# EAGLE design FY - OPTO_BOARD_2_MISC (EAGLE 6.1)
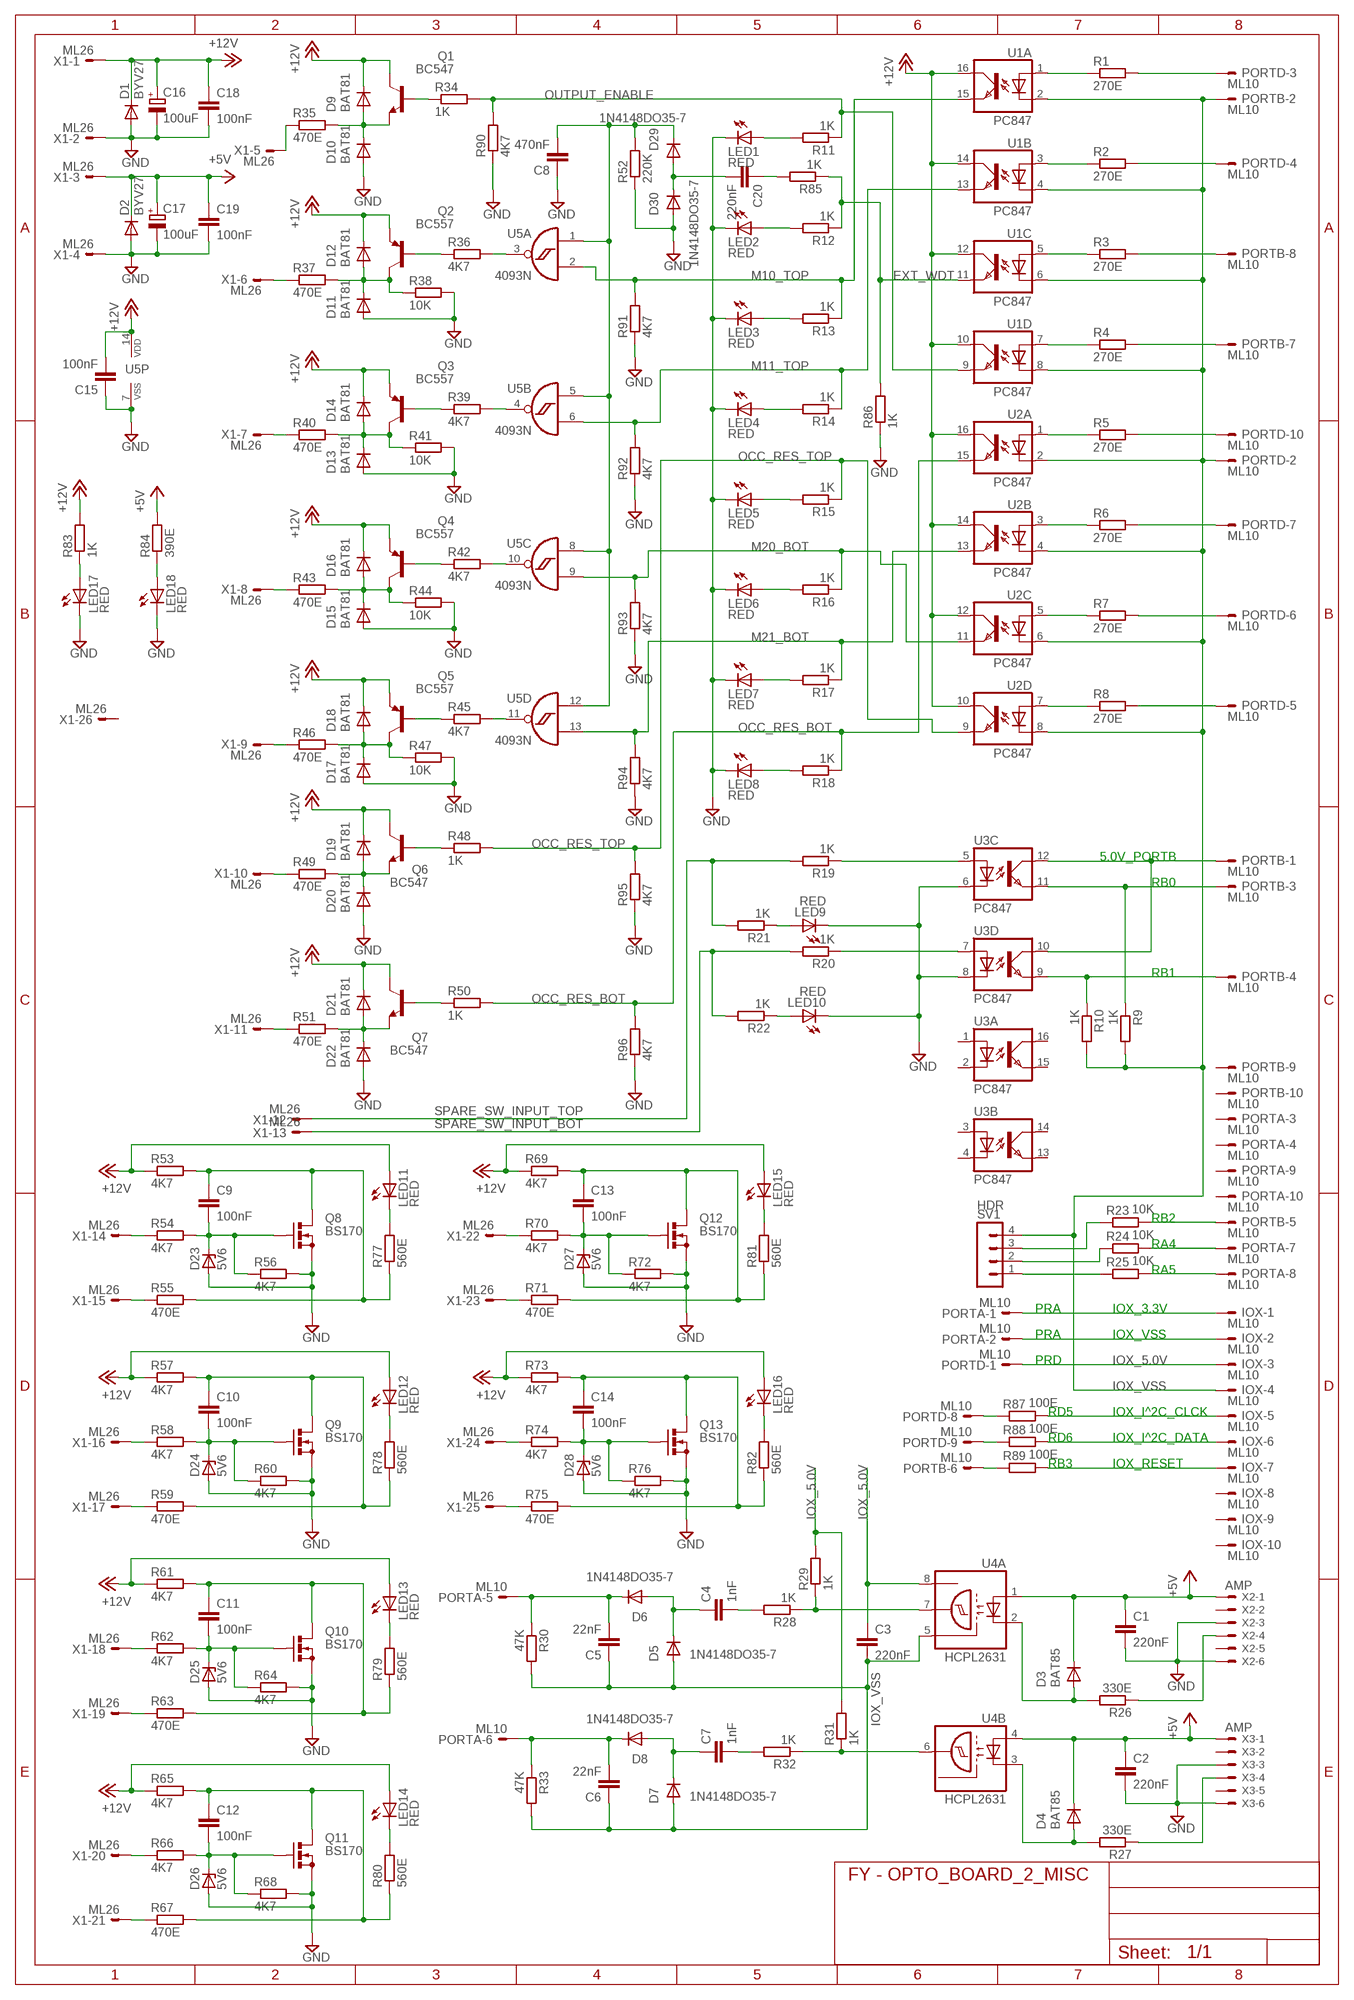
[diagram p0: schematic, sheet 1]

## Parts
C1  220nF  C-EU050-025X075  [C050-025X075]
C2  220nF  C-EU050-025X075  [C050-025X075]
C3  220nF  C-EU050-025X075  [C050-025X075]
C4  1nF  C-EU050-025X075  [C050-025X075]
C5  22nF  C-EU050-025X075  [C050-025X075]
C6  22nF  C-EU050-025X075  [C050-025X075]
C7  1nF  C-EU050-025X075  [C050-025X075]
C8  470nF  C-EU050-025X075  [C050-025X075]
C9  100nF  C-EU050-025X075  [C050-025X075]
C10  100nF  C-EU050-025X075  [C050-025X075]
C11  100nF  C-EU050-025X075  [C050-025X075]
C12  100nF  C-EU050-025X075  [C050-025X075]
C13  100nF  C-EU050-025X075  [C050-025X075]
C14  100nF  C-EU050-025X075  [C050-025X075]
C15  100nF  C-EU050-025X075  [C050-025X075]
C16  100uF  CPOL-EUE5-8.5  [E5-8,5]
C17  100uF  CPOL-EUE5-8.5  [E5-8,5]
C18  100nF  C-EU050-025X075  [C050-025X075]
C19  100nF  C-EU050-025X075  [C050-025X075]
C20  220nF  C-EU050-025X075  [C050-025X075]
D1  BYV27  [SOD57-10]
D2  BYV27  [SOD57-10]
D3  BAT85  BAT81  [DO34-7]
D4  BAT85  BAT81  [DO34-7]
D5  1N4148DO35-7  [DO35-7]
D6  1N4148DO35-7  [DO35-7]
D7  1N4148DO35-7  [DO35-7]
D8  1N4148DO35-7  [DO35-7]
D9  BAT81  [DO34-7]
D10  BAT81  [DO34-7]
D11  BAT81  [DO34-7]
D12  BAT81  [DO34-7]
D13  BAT81  [DO34-7]
D14  BAT81  [DO34-7]
D15  BAT81  [DO34-7]
D16  BAT81  [DO34-7]
D17  BAT81  [DO34-7]
D18  BAT81  [DO34-7]
D19  BAT81  [DO34-7]
D20  BAT81  [DO34-7]
D21  BAT81  [DO34-7]
D22  BAT81  [DO34-7]
D23  5V6  ZENER-DIODEDO34-7  [DO34Z7]
D24  5V6  ZENER-DIODEDO34-7  [DO34Z7]
D25  5V6  ZENER-DIODEDO34-7  [DO34Z7]
D26  5V6  ZENER-DIODEDO34-7  [DO34Z7]
D27  5V6  ZENER-DIODEDO34-7  [DO34Z7]
D28  5V6  ZENER-DIODEDO34-7  [DO34Z7]
D29  1N4148DO35-7  [DO35-7]
D30  1N4148DO35-7  [DO35-7]
IOX  ML10  ML10E  [ML10]
LED1  RED  LED3MM  [LED3MM]
LED2  RED  LED3MM  [LED3MM]
LED3  RED  LED3MM  [LED3MM]
LED4  RED  LED3MM  [LED3MM]
LED5  RED  LED3MM  [LED3MM]
LED6  RED  LED3MM  [LED3MM]
LED7  RED  LED3MM  [LED3MM]
LED8  RED  LED3MM  [LED3MM]
LED9  RED  LED3MM  [LED3MM]
LED10  RED  LED3MM  [LED3MM]
LED11  RED  LED3MM  [LED3MM]
LED12  RED  LED3MM  [LED3MM]
LED13  RED  LED3MM  [LED3MM]
LED14  RED  LED3MM  [LED3MM]
LED15  RED  LED3MM  [LED3MM]
LED16  RED  LED3MM  [LED3MM]
LED17  RED  LED3MM  [LED3MM]
LED18  RED  LED3MM  [LED3MM]
PORTA  ML10  ML10E  [ML10]
PORTB  ML10  ML10E  [ML10]
PORTD  ML10  ML10E  [ML10]
Q1  BC547  [TO92]
Q2  BC557  [TO92]
Q3  BC557  [TO92]
Q4  BC557  [TO92]
Q5  BC557  [TO92]
Q6  BC547  [TO92]
Q7  BC547  [TO92]
Q8  BS170  [SOT54E]
Q9  BS170  [SOT54E]
Q10  BS170  [SOT54E]
Q11  BS170  [SOT54E]
Q12  BS170  [SOT54E]
Q13  BS170  [SOT54E]
R1  270E  R-EU_0207/10  [0207/10]
R2  270E  R-EU_0207/10  [0207/10]
R3  270E  R-EU_0207/10  [0207/10]
R4  270E  R-EU_0207/10  [0207/10]
R5  270E  R-EU_0207/10  [0207/10]
R6  270E  R-EU_0207/10  [0207/10]
R7  270E  R-EU_0207/10  [0207/10]
R8  270E  R-EU_0207/10  [0207/10]
R9  1K  R-EU_0207/10  [0207/10]
R10  1K  R-EU_0207/10  [0207/10]
R11  1K  R-EU_0207/10  [0207/10]
R12  1K  R-EU_0207/10  [0207/10]
R13  1K  R-EU_0207/10  [0207/10]
R14  1K  R-EU_0207/10  [0207/10]
R15  1K  R-EU_0207/10  [0207/10]
R16  1K  R-EU_0207/10  [0207/10]
R17  1K  R-EU_0207/10  [0207/10]
R18  1K  R-EU_0207/10  [0207/10]
R19  1K  R-EU_0207/10  [0207/10]
R20  1K  R-EU_0207/10  [0207/10]
R21  1K  R-EU_0207/10  [0207/10]
R22  1K  R-EU_0207/10  [0207/10]
R23  10K  R-EU_0207/10  [0207/10]
R24  10K  R-EU_0207/10  [0207/10]
R25  10K  R-EU_0207/10  [0207/10]
R26  330E  R-EU_0207/10  [0207/10]
R27  330E  R-EU_0207/10  [0207/10]
R28  1K  R-EU_0207/10  [0207/10]
R29  1K  R-EU_0207/10  [0207/10]
R30  47K  R-EU_0207/10  [0207/10]
R31  1K  R-EU_0207/10  [0207/10]
R32  1K  R-EU_0207/10  [0207/10]
R33  47K  R-EU_0207/10  [0207/10]
R34  1K  R-EU_0207/10  [0207/10]
R35  470E  R-EU_0207/10  [0207/10]
R36  4K7  R-EU_0207/10  [0207/10]
R37  470E  R-EU_0207/10  [0207/10]
R38  10K  R-EU_0207/10  [0207/10]
R39  4K7  R-EU_0207/10  [0207/10]
R40  470E  R-EU_0207/10  [0207/10]
R41  10K  R-EU_0207/10  [0207/10]
R42  4K7  R-EU_0207/10  [0207/10]
R43  470E  R-EU_0207/10  [0207/10]
R44  10K  R-EU_0207/10  [0207/10]
R45  4K7  R-EU_0207/10  [0207/10]
R46  470E  R-EU_0207/10  [0207/10]
R47  10K  R-EU_0207/10  [0207/10]
R48  1K  R-EU_0207/10  [0207/10]
R49  470E  R-EU_0207/10  [0207/10]
R50  1K  R-EU_0207/10  [0207/10]
R51  470E  R-EU_0207/10  [0207/10]
R52  220K  R-EU_0207/10  [0207/10]
R53  4K7  R-EU_0207/10  [0207/10]
R54  4K7  R-EU_0207/10  [0207/10]
R55  470E  R-EU_0207/10  [0207/10]
R56  4K7  R-EU_0207/10  [0207/10]
R57  4K7  R-EU_0207/10  [0207/10]
R58  4K7  R-EU_0207/10  [0207/10]
R59  470E  R-EU_0207/10  [0207/10]
R60  4K7  R-EU_0207/10  [0207/10]
R61  4K7  R-EU_0207/10  [0207/10]
R62  4K7  R-EU_0207/10  [0207/10]
R63  470E  R-EU_0207/10  [0207/10]
R64  4K7  R-EU_0207/10  [0207/10]
R65  4K7  R-EU_0207/10  [0207/10]
R66  4K7  R-EU_0207/10  [0207/10]
R67  470E  R-EU_0207/10  [0207/10]
R68  4K7  R-EU_0207/10  [0207/10]
R69  4K7  R-EU_0207/10  [0207/10]
R70  4K7  R-EU_0207/10  [0207/10]
R71  470E  R-EU_0207/10  [0207/10]
R72  4K7  R-EU_0207/10  [0207/10]
R73  4K7  R-EU_0207/10  [0207/10]
R74  4K7  R-EU_0207/10  [0207/10]
R75  470E  R-EU_0207/10  [0207/10]
R76  4K7  R-EU_0207/10  [0207/10]
R77  560E  R-EU_0207/10  [0207/10]
R78  560E  R-EU_0207/10  [0207/10]
R79  560E  R-EU_0207/10  [0207/10]
R80  560E  R-EU_0207/10  [0207/10]
R81  560E  R-EU_0207/10  [0207/10]
R82  560E  R-EU_0207/10  [0207/10]
R83  1K  R-EU_0207/10  [0207/10]
R84  390E  R-EU_0207/10  [0207/10]
R85  1K  R-EU_0207/10  [0207/10]
R86  1K  R-EU_0207/10  [0207/10]
R87  100E  R-EU_0207/10  [0207/10]
R88  100E  R-EU_0207/10  [0207/10]
R89  100E  R-EU_0207/10  [0207/10]
R90  4K7  R-EU_0207/10  [0207/10]
R91  4K7  R-EU_0207/10  [0207/10]
R92  4K7  R-EU_0207/10  [0207/10]
R93  4K7  R-EU_0207/10  [0207/10]
R94  4K7  R-EU_0207/10  [0207/10]
R95  4K7  R-EU_0207/10  [0207/10]
R96  4K7  R-EU_0207/10  [0207/10]
SV1  HDR  MA04-1  [MA04-1]
U1  PC847  [DIL16]
U2  PC847  [DIL16]
U3  PC847  [DIL16]
U4  HCPL2631  HCPL2231  [DIL08]
U5  4093N  [DIL14]
X1  ML26  ML26E  [ML26]
X2  AMP  22-23-2061  [22-23-2061]
X3  AMP  22-23-2061  [22-23-2061]

## Nets
+5V [power]: C1.1 C2.1 C17.+ C19.1 D2.C D3.C D4.C R84.2 U4.1(A:A) U4.4(B:A) X1.3 X2.1 X3.1
+12V [power]: C15.2 C16.+ C18.1 D1.C D9.C D12.C D14.C D16.C D18.C D19.C D21.C LED11.A LED12.A LED13.A LED14.A LED15.A LED16.A Q1.3(C) Q2.1(E) Q3.1(E) Q4.1(E) Q5.1(E) Q6.3(C) Q7.3(C) R53.1 R57.1 R61.1 R65.1 R69.1 R73.1 R83.2 U1.10(D:COL) U1.12(C:COL) U1.14(B:COL) U1.16(A:COL) U2.10(D:COL) U2.12(C:COL) U2.14(B:COL) U2.16(A:COL) U5.14(P:VDD) X1.1
EXT_WDT: R12.1 R85.1 R86.2 U1.11(C:EMIT)
GND [power]: C1.2 C2.2 C8.1 C15.1 C16.- C17.- C18.2 C19.2 D1.A D2.A D10.A D11.A D13.A D15.A D17.A D20.A D22.A D23.A D24.A D25.A D26.A D27.A D28.A D30.A LED1.K(C) LED2.K(C) LED3.K(C) LED4.K(C) LED5.K(C) LED6.K(C) LED7.K(C) LED8.K(C) LED9.K(C) LED10.K(C) LED17.K(C) LED18.K(C) Q8.S Q9.S Q10.S Q11.S Q12.S Q13.S R38.2 R41.2 R44.2 R47.2 R52.1 R56.2 R60.2 R64.2 R68.2 R72.2 R76.2 R86.1 R90.1 R91.1 R92.1 R93.1 R94.1 R95.1 R96.1 U3.6(C:C) U3.8(D:C) U5.7(P:VSS) X1.2 X1.4 X2.3 X2.6 X3.3 X3.6
IOX_5.0V [power_uP]: C3.1 IOX.3 PORTD.1 R29.2 R31.2 U4.8(A:VCC)
IOX_VSS [power_uP]: C3.2 C5.1 C6.1 D5.A D7.A IOX.4 PORTB.2 PORTD.2 R9.2 R10.2 R30.2 R33.2 SV1.4 U1.2(A:C) U1.4(B:C) U1.6(C:C) U1.8(D:C) U2.2(A:C) U2.4(B:C) U2.6(C:C) U2.8(D:C) U4.5(A:GND)
M10_TOP: R13.1 R91.2 U1.15(A:EMIT) U5.2(A:I1)
M11_TOP: R14.1 R92.2 U1.13(B:EMIT) U5.6(B:I1)
M20_BOT: R16.1 R93.2 U2.11(C:EMIT) U5.9(C:I1)
M21_BOT: R17.1 R94.2 U2.13(B:EMIT) U5.13(D:I1)
N$1: R1.1 U1.1(A:A)
N$2: R2.1 U1.3(B:A)
N$3: R3.1 U1.5(C:A)
N$4: R4.1 U1.7(D:A)
N$5: LED1.A R11.2
N$6: LED2.A R12.2
N$7: LED3.A R13.2
N$8: LED4.A R14.2
N$9: Q2.2(B) R36.1
N$10 [power]: C10.1 Q9.D R57.2 R59.2 R78.1
N$11: C8.2 D29.C R52.2 U5.1(A:I0) U5.5(B:I0) U5.8(C:I0) U5.12(D:I0)
N$12: LED11.K(C) R77.2
N$13: R23.1 SV1.3
N$14: R5.1 U2.1(A:A)
N$15: R6.1 U2.3(B:A)
N$16: R7.1 U2.5(C:A)
N$17: R8.1 U2.7(D:A)
N$18: C9.2 D23.C Q8.G R54.2 R56.1
N$19: R19.1 U3.5(C:A)
N$20: R20.1 U3.7(D:A)
N$21: LED12.K(C) R78.2
N$22: LED5.A R15.2
N$23: LED6.A R16.2
N$24: LED7.A R17.2
N$25: LED8.A R18.2
N$26: PORTD.5 R8.2
N$27: Q1.2(B) R34.1
N$28: PORTD.6 R7.2
N$29: PORTD.7 R6.2
N$30: PORTD.10 R5.2
N$31: PORTD.4 R2.2
N$32: PORTD.3 R1.2
N$34: C10.2 D24.C Q9.G R58.2 R60.1
N$35: LED9.A R21.1
N$36: LED10.A R22.1
N$37 [power_uP]: PORTB.1 U3.10(D:COL) U3.12(C:COL)
N$38: LED17.A R83.1
N$39: PORTB.8 R3.2
N$40: PORTB.3 R9.1 U3.11(C:EMIT)
N$41: PORTB.4 R10.1 U3.9(D:EMIT)
N$42: PORTB.7 R4.2
N$43: LED18.A R84.1
N$44: C4.2 R28.2
N$45: R24.1 SV1.2
N$46: R25.1 SV1.1
N$47: PORTB.5 R23.2
N$48: PORTA.7 R24.2
N$49: PORTA.8 R25.2
N$50 [power_uP]: IOX.1 PORTA.1
N$51 [power_uP]: IOX.2 PORTA.2
N$52: IOX.7 R89.2
N$53: IOX.5 R87.2
N$54: IOX.6 R88.2
N$55: D9.A D10.C Q1.1(E) R35.2
N$56: D3.A R26.2 U4.2(A:C)
N$57: R35.1 X1.5
N$58: R26.1 X2.4
N$59: R27.1 X3.4
N$60: D4.A R27.2 U4.3(B:C)
N$61: R37.1 X1.6
N$62: D11.C D12.A Q2.3(C) R37.2 R38.1
N$63: R36.2 U5.3(A:O)
N$64: R28.1 R29.1 U4.7(A:OUT)
N$65: R31.1 R32.1 U4.6(B:OUT)
N$66: C7.2 R32.2
N$67: C20.2 D29.A D30.C
N$68: C5.2 D6.C PORTA.5 R30.1
N$69: C7.1 D7.C D8.A
N$70: C4.1 D5.C D6.A
N$71: C20.1 R85.2
N$72: C6.2 D8.C PORTA.6 R33.1
N$73: PORTD.8 R87.1
N$74: Q3.2(B) R39.1
N$75: D13.C D14.A Q3.3(C) R40.2 R41.1
N$76: R40.1 X1.7
N$77: Q4.2(B) R42.1
N$78: D15.C D16.A Q4.3(C) R43.2 R44.1
N$79: R43.1 X1.8
N$80: Q5.2(B) R45.1
N$81: D17.C D18.A Q5.3(C) R46.2 R47.1
N$82: R46.1 X1.9
N$83: R39.2 U5.4(B:O)
N$84: R42.2 U5.10(C:O)
N$85: R45.2 U5.11(D:O)
N$86: D19.A D20.C Q6.1(E) R49.2
N$87: Q6.2(B) R48.1
N$88: R49.1 X1.10
N$89: D21.A D22.C Q7.1(E) R51.2
N$90: Q7.2(B) R50.1
N$91: R51.1 X1.11
N$93: C11.2 D25.C Q10.G R62.2 R64.1
N$95: C12.2 D26.C Q11.G R66.2 R68.1
N$97: C13.2 D27.C Q12.G R70.2 R72.1
N$99: C14.2 D28.C Q13.G R74.2 R76.1
N$100: R54.1 X1.14
N$101: R55.1 X1.15
N$102: R58.1 X1.16
N$103: R59.1 X1.17
N$104: R62.1 X1.18
N$105: R63.1 X1.19
N$106: R66.1 X1.20
N$107: R67.1 X1.21
N$108: R70.1 X1.22
N$109: R71.1 X1.23
N$110: R74.1 X1.24
N$111: R75.1 X1.25
N$112: LED13.K(C) R79.2
N$113: LED14.K(C) R80.2
N$114: LED15.K(C) R81.2
N$115: LED16.K(C) R82.2
N$116: PORTD.9 R88.1
N$117: PORTB.6 R89.1
N$118 [power]: C9.1 Q8.D R53.2 R55.2 R77.1
N$119 [power]: C11.1 Q10.D R61.2 R63.2 R79.1
N$120 [power]: C12.1 Q11.D R65.2 R67.2 R80.1
N$121 [power]: C14.1 Q13.D R73.2 R75.2 R82.1
N$122 [power]: C13.1 Q12.D R69.2 R71.2 R81.1
OCC_RES_BOT: R18.1 R50.2 R96.2 U2.15(A:EMIT)
OCC_RES_TOP: R15.1 R48.2 R95.2 U2.9(D:EMIT)
OUTPUT_ENABLE: R11.1 R34.2 R90.2 U1.9(D:EMIT)
SPARE_SW_INPUT_BOT: R20.2 R22.2 X1.13
SPARE_SW_INPUT_TOP: R19.2 R21.2 X1.12
Unconnected: IOX.8 IOX.9 IOX.10 PORTA.3 PORTA.4 PORTA.9 PORTA.10 PORTB.9 PORTB.10 U3.1(A:A) U3.2(A:C) U3.3(B:A) U3.4(B:C) U3.13(B:EMIT) U3.14(B:COL) U3.15(A:EMIT) U3.16(A:COL) X1.26 X2.2 X2.5 X3.2 X3.5

## Notes on the sheet
- 5.0V_PORTB
- RB0
- RB1
- RB2
- RA4
- RA5
- PRA | IOX_3.3V
- PRA | IOX_VSS
- PRD
- RD5 | IOX_I^2C_CLCK
- RD6 | IOX_I^2C_DATA
- RB3 | IOX_RESET

## Library data of the parts
C1-C15 C18-C20 = rcl:C-EU: CAPACITOR, European symbol
C16 C17 = rcl:CPOL-EU: POLARIZED CAPACITOR, European symbol
D1 D2 = diode:BYV27: DIODE ultra fast
D3 D4 D9-D22 = diode:BAT81: DIODE barrier diode
D5-D8 D29 D30 = diode:1N4148: DIODE high speed (Philips)
D23-D28 = diode:ZENER-DIODE: Z-Diode
IOX PORTA PORTB PORTD = con-harting-ml:ML10?E: HARTING; OC_FARNELL: unknown; OC_NEWARK: unknown
LED1-LED18 = led:LED: LED OSRAM: - CHIPLED LG R971, LG N971, LY N971, LG Q971, LY Q971, LO R971, LY R971 LH N974, LH R974 LS Q976, LO Q976, LY Q976 LO Q996 - Hyper CHIPLED LW Q18S LB Q993, LB Q99A, LB R99A - SideLED LS A670, LO A670, LY A670, LG A670, LP A670 LB A673, LV A673, LT A673, LW A673 LH A674 LY A675 LS A676, LA A676, LO A676, LY A676, LW A676 LS A679, LY A679, LG A679 - Hyper Micro SIDELED® LS Y876, LA Y876, LO Y876, LY Y876 LT Y87S - SmartLED LW L88C, LW L88S LB L89C, LB L89S, LG L890 LS L89K, LO L89K, LY L89K LS L896, LA L896, LO L896, LY L896 - TOPLED LS T670, LO T670, LY T670, LG T670, LP T670 LSG T670, LSP T670, LSY T670, LOP T670, LYG T670 LG T671, LOG T671, LSG T671 LB T673, LV T673, LT T673, LW T673 LH T674 LS T676, LA T676, LO T676, LY T676, LB T676, LH T676, LSB T676, LW T676 LB T67C, LV T67C, LT T67C, LS T67K, LO T67K, LY T67K, LW E67C LS E67B, LA E67B, LO E67B, LY E67B, LB E67C, LV E67C, LT E67C LW T67C LS T679, LY T679, LG T679 LS T770, LO T770, LY T770, LG T770, LP T770 LB T773, LV T773, LT T773, LW T773 LH T774 LS E675, LA E675, LY E675, LS T675 LS T776, LA T776, LO T776, LY T776, LB T776 LHGB T686 LT T68C, LB T68C - Hyper Mini TOPLED® LB M676 - Mini TOPLED Santana® LG M470 LS M47K, LO M47K, LY M47K Source: http://www.osram.convergy.de LUXEON: - LUMILED® LXK2-PW12-R00, LXK2-PW12-S00, LXK2-PW14-U00, LXK2-PW14-V00 LXK2-PM12-R00, LXK2-PM12-S00, LXK2-PM14-U00 LXK2-PE12-Q00, LXK2-PE12-R00, LXK2-PE12-S00, LXK2-PE14-T00, LXK2-PE14-U00 LXK2-PB12-K00, LXK2-PB12-L00, LXK2-PB12-M00, LXK2-PB14-N00, LXK2-PB14-P00, LXK2-PB14-Q00 LXK2-PR12-L00, LXK2-PR12-M00, LXK2-PR14-Q00, LXK2-PR14-R00 LXK2-PD12-Q00, LXK2-PD12-R00, LXK2-PD12-S00 LXK2-PH12-R00, LXK2-PH12-S00 LXK2-PL12-P00, LXK2-PL12-Q00, LXK2-PL12-R00 Source: www.luxeon.com KINGBRIGHT: KA-3528ASYC Source: www.kingbright.com
Q1 Q6 Q7 = transistor-npn:BC547*: NPN Transistor
Q2-Q5 = transistor-pnp:BC557: PNP Transistor
Q8-Q13 = transistor-small-signal:BS170: N-CHANNEL MOS FET
R1-R96 = rcl:R-EU_: RESISTOR, European symbol
SV1 = con-lstb:MA04-1: PIN HEADER; OC_FARNELL: unknown; OC_NEWARK: unknown
U1-U3 = optocoupler:PC847: SHARP OPTO COUPLER; OC_FARNELL: 9707735; OC_NEWARK: unknown
U4 = optocoupler:HCPL2231: HEWLETT PACKARD OPTO COUPLER; MF: AGILENT TECHNOLOGIES; MPN: HCPL-2231-000E; OC_FARNELL: 9994955; OC_NEWARK: 88H7801
U5 = 40xx:4093: Quad 2-input NAND schmitt trigger
X1 = con-harting-ml:ML26?E: HARTING; OC_FARNELL: unknown; OC_NEWARK: unknown
X2 X3 = con-molex:22-23-2061: .100" (2.54mm) Center Header - 6 Pin; MF: MOLEX; MPN: 22-23-2061; OC_FARNELL: 1462922; OC_NEWARK: 27C1933

## Net classes
0 default: width 0.305 mm, drill 0.5 mm, clearance 0.203 mm
1 power: width 0.61 mm, clearance 0.203 mm
2 power_uP: width 0.406 mm, clearance 0.203 mm

## Board
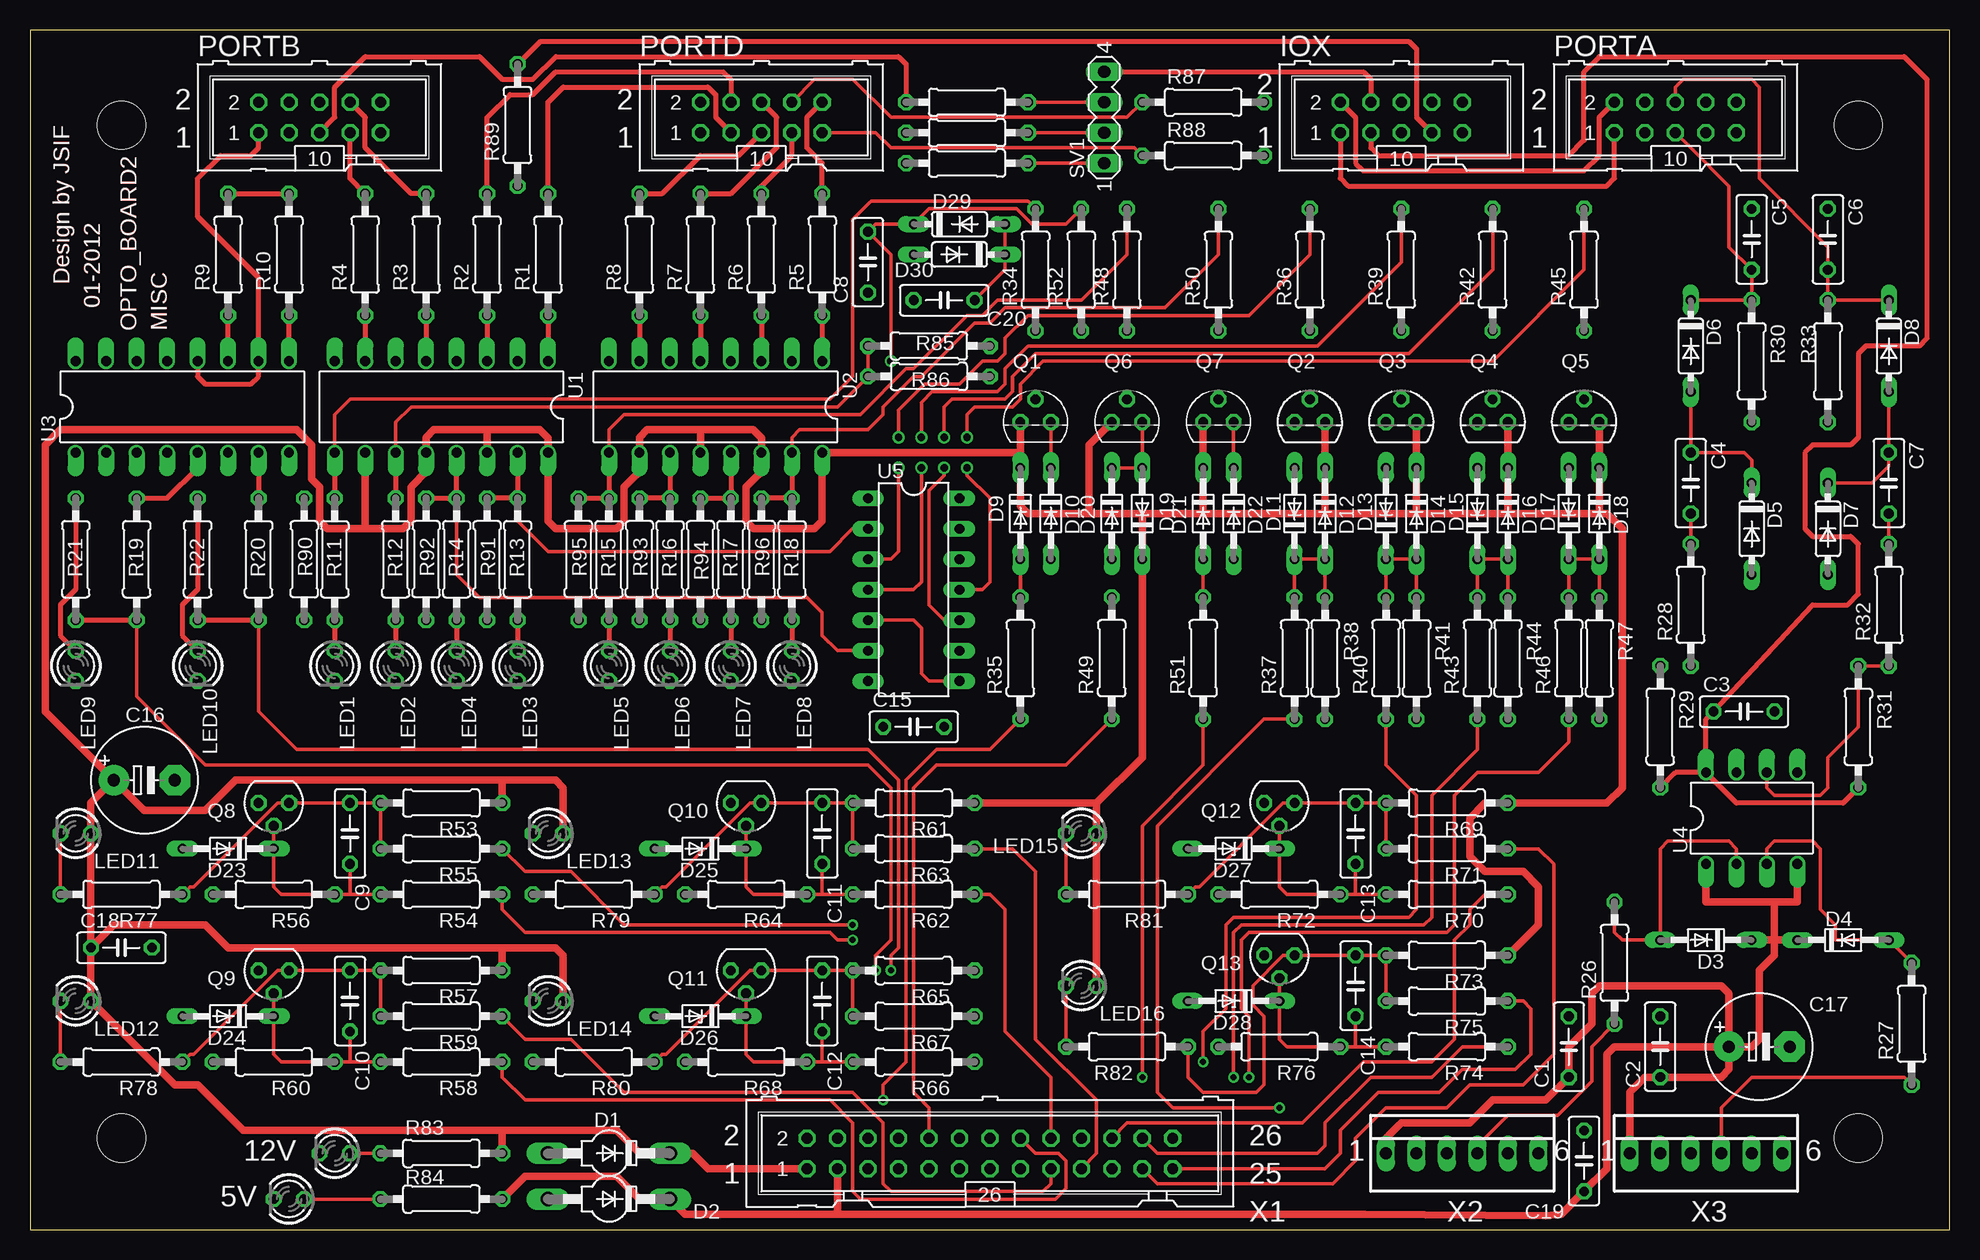
[diagram p1: board, top side]
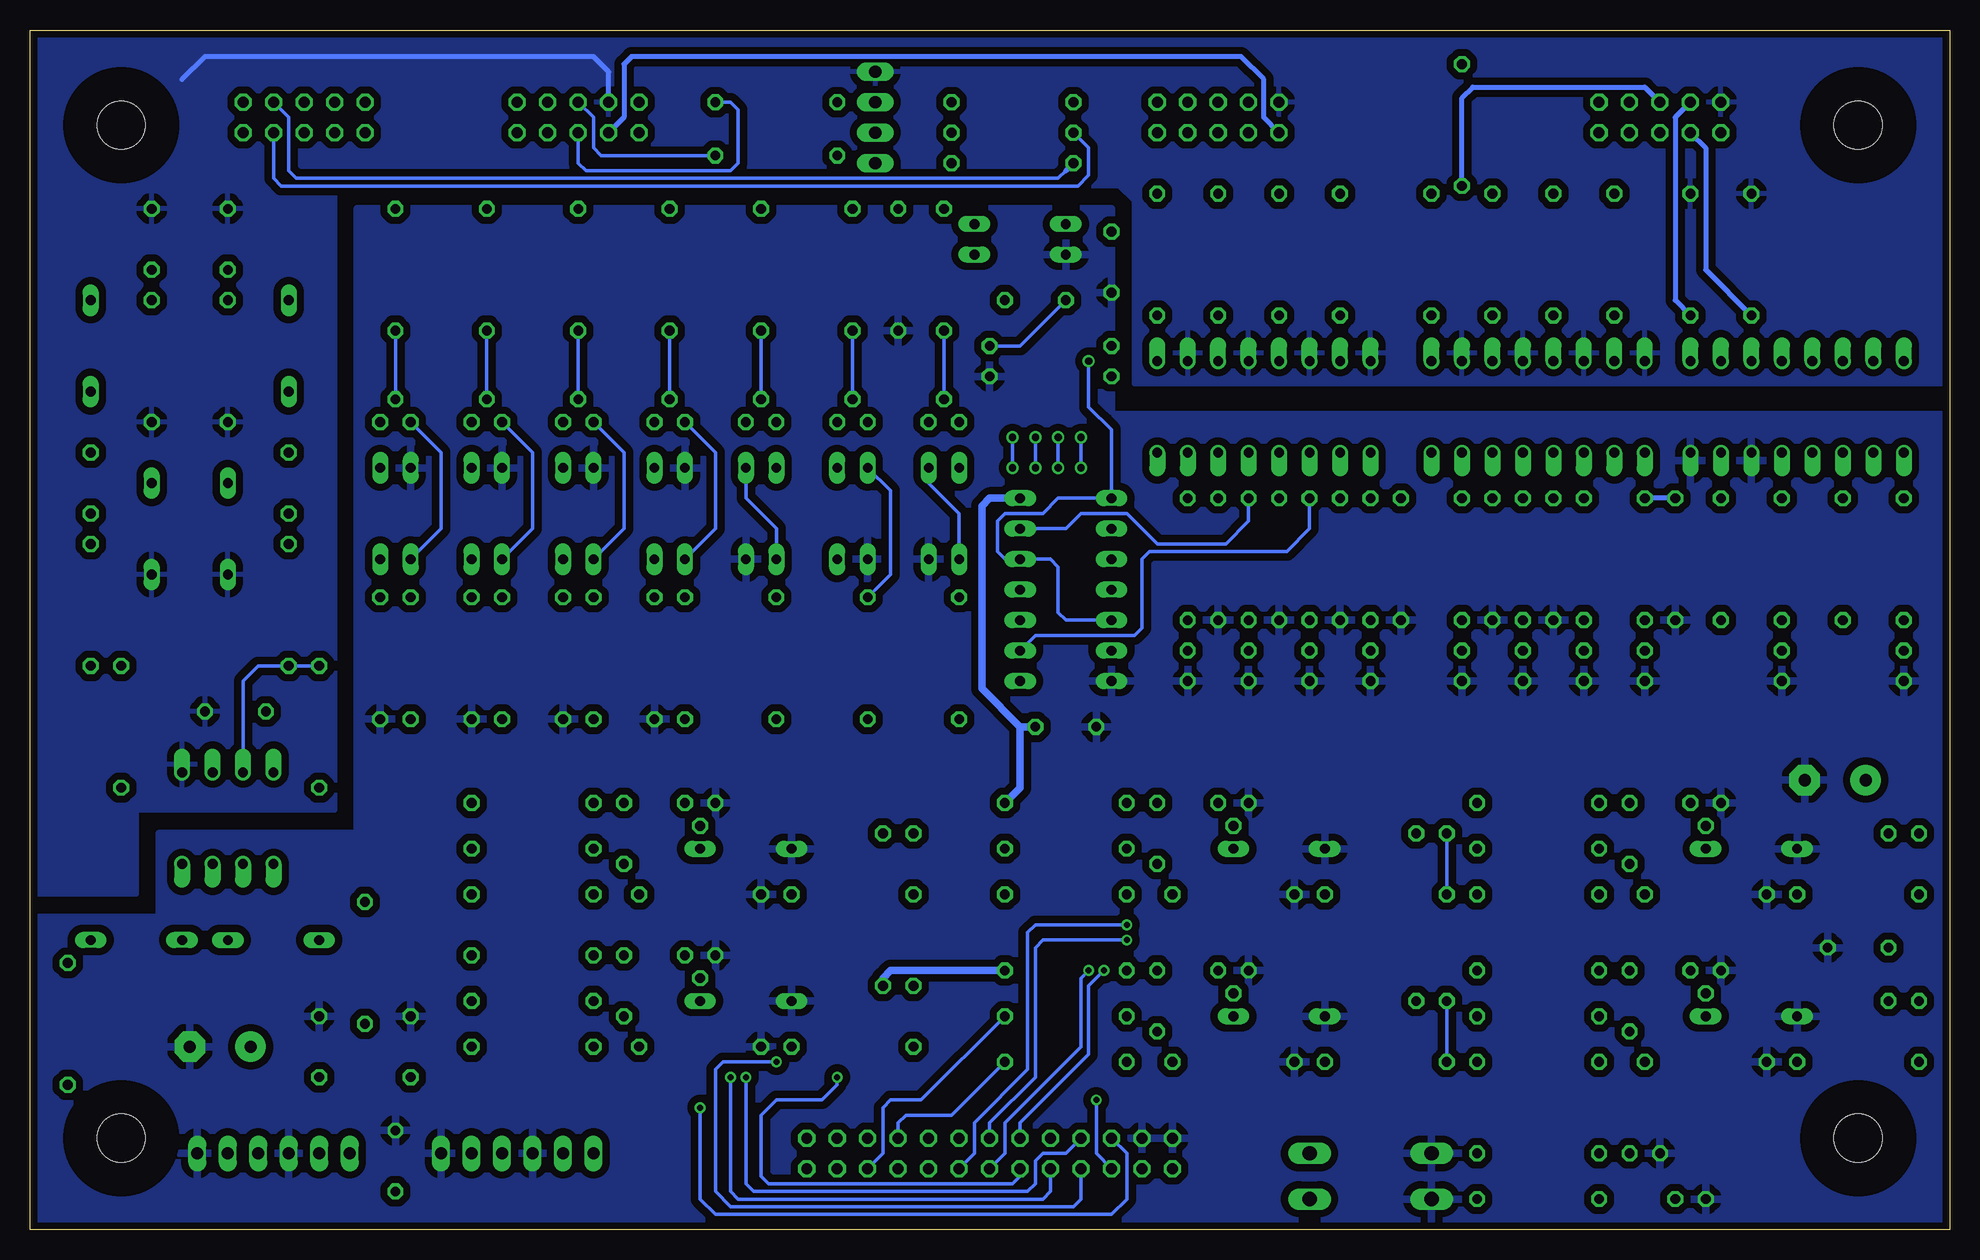
[diagram p2: board, bottom side, seen from below]

Size 160 x 100 mm. Coordinates in mm from the lower left corner, seen from the top.
Outline: 0,0 160,0 160,100 0,100 0,0
Copper layers (1*16): Top 0.035mm / dielectric 1.5mm / Bottom 0.035mm
Design rules: minimum track width 12mil, minimum drill 12mil, track to track 8mil, track to pad 8mil, pad to pad 8mil, via to via 8mil, smd to smd 8mil, copper to edge 24mil, drill to drill 8mil, minimum pad ring 10mil, minimum via ring 8mil, stop-mask expansion 4mil, vias tented up to drill 0mil, thermal gap 24mil
Holes 4 mm at 7.62,7.62 7.62,92.08 152.4,92.08 152.4,7.62
bRestrict: area 3.6,88.1 to 11.6,96.1; area 3.6,3.6 to 11.6,11.6; area 148.4,3.6 to 156.4,11.6; area 148.4,88.1 to 156.4,96.1

### Footprints (pad centres in the part's own frame; a part is rotated, then mirrored left to right if it is on the bottom)
C050-025X075 = drill 0.813 octagon: 1 -2.54,0; 2 2.54,0
E5-8,5 = drill 1.016 pad 2.54: + -2.54,0 | drill 1.016 pad 2.54 octagon: - 2.54,0
SOD57-10 = drill 1.194 long: A 5.08,0; C -5.08,0
DO34-7 = drill 0.813 long: A 3.81,0; C -3.81,0
DO35-7 = drill 0.813 long: A 3.81,0; C -3.81,0
DO34Z7 = drill 0.813 long: A 3.81,0; C -3.81,0
ML10 = drill 0.914 octagon: 1 -5.08,-1.27; 2 -5.08,1.27; 3 -2.54,-1.27; 4 -2.54,1.27; 5 0,-1.27; 6 0,1.27; 7 2.54,-1.27; 8 2.54,1.27; 9 5.08,-1.27; 10 5.08,1.27
LED3MM = drill 0.813 octagon: A -1.27,0; K 1.27,0
TO92 = drill 0.813 octagon: 1 1.27,0; 2 0,1.905; 3 -1.27,0
SOT54E = drill 0.813 octagon: D -1.27,0; G 0,1.905; S 1.27,0
0207/10 = drill 0.813 octagon: 1 -5.08,0; 2 5.08,0
MA04-1 = drill 1.016 long: 1 -3.81,0; 2 -1.27,0; 3 1.27,0; 4 3.81,0
DIL16 = drill 0.813 offset: 1 -8.89,-3.81; 2 -6.35,-3.81; 3 -3.81,-3.81; 4 -1.27,-3.81; 5 1.27,-3.81; 6 3.81,-3.81; 7 6.35,-3.81; 8 8.89,-3.81; 9 8.89,3.81; 10 6.35,3.81; 11 3.81,3.81; 12 1.27,3.81; 13 -1.27,3.81; 14 -3.81,3.81; 15 -6.35,3.81; 16 -8.89,3.81
DIL08 = drill 0.813 offset: 1 -3.81,-3.81; 2 -1.27,-3.81; 3 1.27,-3.81; 4 3.81,-3.81; 5 3.81,3.81; 6 1.27,3.81; 7 -1.27,3.81; 8 -3.81,3.81
DIL14 = drill 0.813 long: 1 -7.62,-3.81; 2 -5.08,-3.81; 3 -2.54,-3.81; 4 0,-3.81; 5 2.54,-3.81; 6 5.08,-3.81; 7 7.62,-3.81; 8 7.62,3.81; 9 5.08,3.81; 10 2.54,3.81; 11 0,3.81; 12 -2.54,3.81; 13 -5.08,3.81; 14 -7.62,3.81
ML26 = drill 0.914 octagon: 1 -15.24,-1.27; 2 -15.24,1.27; 3 -12.7,-1.27; 4 -12.7,1.27; 5 -10.16,-1.27; 6 -10.16,1.27; 7 -7.62,-1.27; 8 -7.62,1.27; 9 -5.08,-1.27; 10 -5.08,1.27; 11 -2.54,-1.27; 12 -2.54,1.27; 13 0,-1.27; 14 0,1.27; 15 2.54,-1.27; 16 2.54,1.27; 17 5.08,-1.27; 18 5.08,1.27; 19 7.62,-1.27; 20 7.62,1.27; 21 10.16,-1.27; 22 10.16,1.27; 23 12.7,-1.27; 24 12.7,1.27; 25 15.24,-1.27; 26 15.24,1.27
22-23-2061 = drill 1 long: 1 -6.35,0; 2 -3.81,0; 3 -1.27,0; 4 1.27,0; 5 3.81,0; 6 6.35,0

### Placement (x,y rotation side)
C1  128.27,15.24 90 top
C2  135.89,15.24 90 top
C3  142.88,43.18 0 top
C4  138.43,62.23 270 top
C5  143.51,82.55 270 top
C6  149.86,82.55 270 top
C7  154.94,62.23 270 top
C8  69.85,80.64 90 top
C9  26.67,33.02 270 top
C10  26.67,19.05 270 top
C11  66.04,33.02 270 top
C12  66.04,19.05 270 top
C13  110.49,33.02 270 top
C14  110.49,20.32 270 top
C15  73.66,41.91 0 top
C16  9.53,37.47 0 top
C17  144.15,15.24 0 top
C18  7.62,23.5 0 top
C19  129.54,5.71 90 top
C20  76.2,77.47 0 top
D1  48.26,6.35 180 top
D2  48.26,2.54 180 top
D3  139.7,24.13 180 top
D4  151.13,24.13 0 top
D5  143.51,58.42 270 top
D6  138.43,73.66 270 top
D7  149.86,58.42 270 top
D8  154.94,73.66 270 top
D9  82.55,59.69 270 top
D10  85.09,59.69 270 top
D11  105.41,59.69 90 top
D12  107.95,59.69 270 top
D13  113.03,59.69 90 top
D14  115.57,59.69 270 top
D15  120.65,59.69 90 top
D16  123.19,59.69 270 top
D17  128.27,59.69 90 top
D18  130.81,59.69 270 top
D19  92.71,59.69 90 top
D20  90.17,59.69 270 top
D21  97.79,59.69 270 top
D22  100.33,59.69 270 top
D23  16.51,31.75 180 top
D24  16.51,17.78 180 top
D25  55.88,31.75 180 top
D26  55.88,17.78 180 top
D27  100.33,31.75 180 top
D28  100.33,19.05 180 top
D29  77.47,83.82 0 top
D30  77.47,81.28 180 top
IOX  114.3,92.71 0 top
LED1  25.4,46.99 270 top
LED2  30.48,46.99 270 top
LED3  40.64,46.99 270 top
LED4  35.56,46.99 270 top
LED5  48.26,46.99 270 top
LED6  53.34,46.99 270 top
LED7  58.42,46.99 270 top
LED8  63.5,46.99 270 top
LED9  3.81,46.99 270 top
LED10  13.97,46.99 270 top
LED11  3.81,33.02 180 top
LED12  3.81,19.05 180 top
LED13  43.18,33.02 180 top
LED14  43.18,19.05 180 top
LED15  87.63,33.02 180 top
LED16  87.63,20.32 180 top
LED17  25.4,6.35 180 top
LED18  21.59,2.54 180 top
PORTA  137.16,92.71 0 top
PORTB  24.13,92.71 0 top
PORTD  60.96,92.71 0 top
Q1  83.82,67.31 0 top
Q2  106.68,67.31 0 top
Q3  114.3,67.31 0 top
Q4  121.92,67.31 0 top
Q5  129.54,67.31 0 top
Q6  91.44,67.31 0 top
Q7  99.06,67.31 0 top
Q8  20.32,35.56 180 top
Q9  20.32,21.59 180 top
Q10  59.69,35.56 180 top
Q11  59.69,21.59 180 top
Q12  104.14,35.56 180 top
Q13  104.14,22.86 180 top
R1  43.18,81.28 90 top
R2  38.1,81.28 90 top
R3  33.02,81.28 90 top
R4  27.94,81.28 90 top
R5  66.04,81.28 90 top
R6  60.96,81.28 90 top
R7  55.88,81.28 90 top
R8  50.8,81.28 90 top
R9  16.51,81.28 90 top
R10  21.59,81.28 90 top
R11  25.4,55.88 270 top
R12  30.48,55.88 270 top
R13  40.64,55.88 270 top
R14  35.56,55.88 270 top
R15  48.26,55.88 270 top
R16  53.34,55.88 270 top
R17  58.42,55.88 270 top
R18  63.5,55.88 270 top
R19  8.89,55.88 270 top
R20  19.05,55.88 270 top
R21  3.81,55.88 270 top
R22  13.97,55.88 270 top
R23  78.11,93.98 180 top
R24  78.11,91.44 180 top
R25  78.11,88.9 180 top
R26  132.08,22.23 90 top
R27  156.84,17.14 90 top
R28  138.43,52.07 90 top
R29  135.89,41.91 270 top
R30  143.51,72.39 270 top
R31  152.4,41.91 270 top
R32  154.94,52.07 90 top
R33  149.86,72.39 270 top
R34  83.82,80.01 90 top
R35  82.55,47.62 90 top
R36  106.68,80.01 90 top
R37  105.41,47.62 90 top
R38  107.95,47.62 270 top
R39  114.3,80.01 90 top
R40  113.03,47.62 90 top
R41  115.57,47.62 270 top
R42  121.92,80.01 90 top
R43  120.65,47.62 90 top
R44  123.19,47.62 270 top
R45  129.54,80.01 90 top
R46  128.27,47.62 90 top
R47  130.81,47.62 270 top
R48  91.44,80.01 90 top
R49  90.17,47.62 90 top
R50  99.06,80.01 90 top
R51  97.79,47.62 90 top
R52  87.63,80.01 90 top
R53  34.29,35.56 180 top
R54  34.29,27.94 180 top
R55  34.29,31.75 180 top
R56  20.32,27.94 180 top
R57  34.29,21.59 180 top
R58  34.29,13.97 180 top
R59  34.29,17.78 180 top
R60  20.32,13.97 180 top
R61  73.66,35.56 180 top
R62  73.66,27.94 180 top
R63  73.66,31.75 180 top
R64  59.69,27.94 180 top
R65  73.66,21.59 180 top
R66  73.66,13.97 180 top
R67  73.66,17.78 180 top
R68  59.69,13.97 180 top
R69  118.11,35.56 180 top
R70  118.11,27.94 180 top
R71  118.11,31.75 180 top
R72  104.14,27.94 180 top
R73  118.11,22.86 180 top
R74  118.11,15.24 180 top
R75  118.11,19.05 180 top
R76  104.14,15.24 180 top
R77  7.62,27.94 180 top
R78  7.62,13.97 180 top
R79  46.99,27.94 180 top
R80  46.99,13.97 180 top
R81  91.44,27.94 180 top
R82  91.44,15.24 180 top
R83  34.29,6.35 0 top
R84  34.29,2.54 0 top
R85  74.93,73.66 0 top
R86  74.93,71.12 180 top
R87  97.79,93.98 0 top
R88  97.79,89.53 0 top
R89  40.64,92.08 90 top
R90  22.86,55.88 90 top
R91  38.1,55.88 90 top
R92  33.02,55.88 90 top
R93  50.8,55.88 90 top
R94  55.88,55.88 90 top
R95  45.72,55.88 90 top
R96  60.96,55.88 90 top
SV1  89.53,92.71 90 top
U1  34.29,68.58 180 top
U2  57.15,68.58 180 top
U3  12.7,68.58 0 top
U4  143.51,34.29 0 top
U5  73.66,53.34 270 top
X1  80.01,6.35 0 top
X2  119.38,6.35 0 top
X3  139.7,6.35 0 top

### Tracks (layer width: path | path; a pad name or v marks a point on that pad's centre or on a via)
+5V
  Top 0.61: 67.31,1.27 54.61,1.27 D2.C 50.8,2.54 48.9,4.45 41.27,4.45 R84.2 | 67.31,1.27 111.23,1.27 126.36,1.16 127.64,1.27 C19.1 131.44,5.08 131.44,14.61 132.08,15.24 C17.+ | X1.3 67.31,1.27 | U4.1 139.7,27.3 145.41,27.3 | U4.4 147.32,27.3 145.41,27.3 | D4.C 145.41,24.13 | X2.1 113.03,7.62 114.3,8.89 120.02,8.89 121.92,10.79 126.36,10.79 C1.1 128.27,15.24 130.18,17.14 130.18,19.68 130.81,20.32 140.97,20.32 141.6,19.68 C17.+ | 145.41,27.3 145.41,24.13 | X3.1 133.35,11.43 134.62,12.7 C2.1 140.97,12.7 141.6,13.34 C17.+ | D3.C 145.41,24.13 | 145.41,24.13 145.41,22.86 144.15,21.59 144.15,15.88 143.51,15.24 C17.+
+12V
  Top 0.61: Q1.3 82.55,64.77 | Q7.3 D21.C 97.79,59.69 | D12.C Q2.1 107.95,59.69 | Q3.1 D14.C 115.57,59.69 | D16.C Q4.1 123.19,59.69 | D18.C Q5.1 130.81,59.69 | U1.10 27.94,58.42 | 27.94,58.42 31.11,58.42 31.75,59.05 31.75,61.91 33.02,63.18 U1.12 33.02,66.04 33.66,66.67 38.1,66.67 | U1.14 38.1,66.67 | 38.1,66.67 42.47,66.67 43.18,65.97 U1.16 43.18,59.05 43.81,58.42 48.9,58.42 49.53,59.05 49.53,61.91 50.8,63.18 U2.10 50.8,66.04 51.44,66.67 55.88,66.67 | U2.12 55.88,66.67 | 55.88,66.67 60.25,66.67 60.96,65.97 U2.14 60.96,63.18 59.69,61.91 59.69,59.05 60.33,58.42 65.41,58.42 66.04,59.05 U2.16 82.55,64.77 | R61.1 88.9,35.56 | 88.9,35.56 LED15.A LED16.A | X1.1 56.52,5.08 55.24,6.35 D1.C 50.8,6.35 48.9,8.26 39.37,8.26 | C16.+ 1.27,43.18 1.27,65.41 2.54,66.67 22.23,66.67 23.5,65.41 23.5,62.55 24.13,61.91 24.13,59.05 24.77,58.42 27.94,58.42 | C18.1 LED11.A 5.08,35.56 C16.+ | C18.1 LED12.A 12.06,12.06 13.97,12.06 17.78,8.26 39.37,8.26 | 39.37,8.26 R83.2 | R73.1 125.73,25.4 125.73,28.57 124.46,29.84 121.28,29.84 120.02,31.11 120.02,34.29 121.28,35.56 R69.1 131.44,35.56 132.72,36.83 132.72,58.42 131.44,59.69 130.81,59.69 | 82.55,64.77 D9.C 82.55,60.33 83.19,59.69 88.27,59.69 | 97.79,59.69 92.71,59.69 | 92.71,59.69 88.27,59.69 | 92.71,59.69 D19.C 92.71,39.37 88.9,35.56 | 107.95,59.69 97.79,59.69 | 115.57,59.69 107.95,59.69 | 123.19,59.69 115.57,59.69 | 130.81,59.69 123.19,59.69 | Q6.3 88.27,65.41 88.27,59.69 | 39.37,37.47 43.81,37.47 44.45,36.83 LED13.A | 39.37,23.5 R57.1 | LED14.A 44.45,22.86 43.81,23.5 39.37,23.5 | R53.1 39.37,37.47 | C16.+ 9.53,34.92 14.61,34.92 17.14,37.47 39.37,37.47 | 39.37,23.5 16.51,23.5 14.61,25.4 6.99,25.4 C18.1
  Bottom 0.61: LED16.A 88.9,20.95 88.27,21.59 R65.1 | U5.14 80.01,60.96 80.64,60.33 80.64,45.09 77.47,41.91 | 77.47,41.91 77.47,36.83 R61.1 | C15.2 77.47,41.91
EXT_WDT
  Top 0.305: U1.11 30.48,67.31 31.75,68.58 67.31,68.58 R86.2 R85.1
  Top 0.406: U1.11 R12.1
GND
  pour Bottom (isolate 0.61): 0.64,67.94 69.85,67.94 69.85,85.09 132.72,85.09 132.72,33.02 149.22,33.02 149.22,26.04 159.38,26.04 159.38,0.64 0.64,0.64
IOX_5.0V
  Top 0.406: R29.2 137.16,38.1 U4.8 | R31.2 151.13,35.56 142.24,35.56 U4.8 | IOX.3 111.76,90.17 112.39,89.53 128.27,89.53 129.54,90.81 129.54,96.52 130.81,97.79 156.21,97.79 158.12,95.89 158.12,74.3 157.48,73.66 153.03,73.66 152.4,73.03 152.4,66.04 151.76,65.41 148.59,65.41 147.96,64.77 147.96,58.42 148.59,57.78 151.76,57.78 152.4,57.15 152.4,52.97 151.5,52.07 148.59,52.07 C3.1 139.7,42.55 U4.8
  Bottom 0.406: PORTD.1 57.15,92.71 57.15,95.89 59.05,97.79 109.86,97.79 110.49,97.16 110.49,92.71 IOX.3
IOX_VSS
  Top 0.406: R9.2 R10.2 | SV1.4 111.12,96.52 111.76,95.89 IOX.4
  Bottom 0.406: IOX.4 111.76,96.52 113.03,97.79 145.41,97.79 147.32,95.89
  pour Bottom (isolate 0.61): 0.64,99.69 0.64,70.48 67.94,70.48 67.94,85.72 69.22,87 134.62,87 134.62,34.92 151.13,34.92 151.13,27.94 159.38,27.94 159.38,99.69
M10_TOP
  Top 0.305: R13.1 40.64,59.05 43.18,56.52 66.67,56.52 68.58,58.42 U5.2
  Top 0.406: U1.15 R13.1 R91.2
M11_TOP
  Top 0.305: R14.1 35.56,54.61 37.47,52.7 64.77,52.7 66.04,51.44 66.04,49.53 67.31,48.26 U5.6
  Top 0.406: U1.13 R14.1 R92.2
M20_BOT
  Top 0.406: U2.11 R16.1 R93.2
  Bottom 0.305: R16.1 53.34,58.42 55.24,56.52 66.67,56.52 67.31,55.88 67.31,50.16 67.94,49.53 76.2,49.53 U5.9
M21_BOT
  Top 0.406: U2.13 R17.1 R94.2
  Bottom 0.305: R17.1 58.42,59.05 60.33,57.15 66.04,57.15 68.58,59.69 72.39,59.69 73.66,58.42 U5.13
N$1
  Top 0.406: R1.1 U1.1
N$2
  Top 0.406: R2.1 U1.3
N$3
  Top 0.406: R3.1 U1.5
N$4
  Top 0.406: R4.1 U1.7
N$5
  Top 0.406: R11.2 LED1.A
N$6
  Top 0.406: R12.2 LED2.A
N$7
  Top 0.406: R13.2 LED3.A
N$8
  Top 0.406: R14.2 LED4.A
N$9
  Bottom 0.305: R36.1 Q2.2
N$10
  Top 0.305: R59.2 R57.2 C10.1 Q9.D 20.64,21.59 13.65,14.61 13.34,14.61 R78.1
N$11  (via drill 0.6)
  Top 0.305: U5.5 73.66,50.8 74.3,50.16 74.3,46.35 74.93,45.72 U5.8 | R52.2 86.36,83.82 83.5,83.82 82.23,85.09 74.93,85.09 D29.C 70.48,83.82 C8.2 71.75,81.28 v71.75,72.39
  Bottom 0.305: U5.5 73.66,50.8 74.3,51.44 74.3,55.24 74.93,55.88 U5.12 78.74,55.88 79.38,56.52 79.38,59.05 78.74,59.69 75.56,59.69 74.3,60.96 U5.1 69.85,66.67 71.75,68.58 v71.75,72.39
N$12
  Top 0.305: LED11.K R77.2
N$13
  Top 0.305: R23.1 SV1.3
N$14
  Top 0.406: R5.1 U2.1
N$15
  Top 0.406: R6.1 U2.3
N$16
  Top 0.406: R7.1 U2.5
N$17
  Top 0.406: R8.1 U2.7
N$18
  Top 0.305: Q8.G D23.C 20.32,28.57 20.95,27.94 R56.1 26.67,27.94 | 26.67,27.94 R54.2 | C9.2 26.67,27.94
N$19
  Top 0.406: R19.1 11.43,60.96 13.97,63.5 U3.5
N$20
  Top 0.406: U3.7 R20.1
N$21
  Top 0.305: LED12.K R78.2
N$22
  Top 0.406: R15.2 LED5.A
N$23
  Top 0.406: R16.2 LED6.A
N$24
  Top 0.406: R17.2 LED7.A
N$25
  Top 0.406: R18.2 LED8.A
N$26
  Top 0.406: R8.2 52.7,86.36 55.88,89.53 59.05,89.53 PORTD.5
N$27
  Bottom 0.305: R34.1 Q1.2
N$28
  Top 0.406: R7.2 58.42,86.36 62.23,90.17 62.23,92.71 PORTD.6
N$29
  Top 0.406: R6.2 60.96,87 63.5,89.53 PORTD.7
N$30
  Top 0.406: R5.2 66.04,88.9 64.77,90.17 64.77,92.71 PORTD.10
N$31
  Top 0.406: R2.2 38.1,92.71 40.01,94.61 41.91,94.61 43.81,96.52 57.78,96.52 58.42,95.89 PORTD.4
N$32
  Top 0.406: R1.2 43.18,93.98 44.45,95.25 56.52,95.25 57.15,94.61 57.15,92.71 PORTD.3
N$34
  Top 0.305: Q9.G D24.C 20.32,14.61 20.95,13.97 R60.1 26.67,13.97 | 26.67,13.97 R58.2 | C10.2 26.67,13.97
N$35
  Top 0.406: R21.1 3.81,53.34 2.54,52.07 2.54,49.53 LED9.A
N$36
  Top 0.406: R22.1 13.97,53.34 12.7,52.07 12.7,49.53 LED10.A
N$37
  Top 0.406: U3.12 13.97,71.12 14.61,70.48 18.41,70.48 19.05,71.12 U3.10 19.05,79.38 13.97,84.45 13.97,87.63 15.88,89.53 18.41,89.53 19.05,90.17 PORTB.1
N$38
  Top 0.305: R83.1 LED17.A
N$39
  Top 0.406: R3.2 31.75,86.36 27.94,90.17 27.94,92.71 PORTB.8
N$40
  Top 0.406: U3.11 R9.1
  Bottom 0.406: PORTB.3 20.32,90.17 20.32,80.01 R9.1
N$41
  Top 0.406: U3.9 R10.1
  Bottom 0.406: PORTB.4 22.86,92.71 22.86,77.47 R10.1
N$42
  Top 0.406: R4.2 26.67,87.63 PORTB.7
N$43
  Top 0.305: R84.1 LED18.A
N$44
  Top 0.305: R28.2 C4.2
N$45
  Top 0.305: SV1.2 R24.1
N$46
  Top 0.305: R25.1 SV1.1
N$47
  Top 0.406: PORTB.5 25.4,92.71 25.4,95.25 27.94,97.79 37.47,97.79 39.37,95.89 41.91,95.89 43.81,97.79 72.39,97.79 73.03,97.16 R23.2
N$48
  Bottom 0.305: R24.2 71.75,90.17 71.75,87.89 72.65,87 139.06,87 139.7,87.63 PORTA.7
N$49
  Bottom 0.305: 73.66,88.27 74.3,87.63 137.79,87.63 138.43,88.27 138.43,92.71 PORTA.8
  Bottom 0.406: R25.2 73.66,88.27
N$50
  Top 0.406: IOX.1 109.22,87.63 109.86,87 131.44,87 132.08,87.63 PORTA.1
N$51
  Top 0.406: IOX.2 110.49,92.71 110.49,88.9 111.12,88.27 129.54,88.27 130.81,89.53 130.81,92.71 PORTA.2
N$52
  Top 0.406: IOX.7 115.57,92.71 115.57,98.42 114.94,99.06 42.55,99.06 R89.2
N$53
  Bottom 0.305: IOX.5 114.3,88.9 113.67,88.27 101.6,88.27 100.97,88.9 100.97,93.34 101.6,93.98 R87.2
N$54
  Bottom 0.305: IOX.6 113.03,92.71 113.03,90.17 112.39,89.53 R88.2
N$55
  Top 0.305: Q1.1 D10.C | R35.2 D9.A
  Bottom 0.305: D9.A 82.55,59.69 85.09,62.23 D10.C
N$56
  Top 0.305: U4.2 142.24,31.75 141.6,32.38 136.53,32.38 135.89,31.75 D3.A 132.72,24.13 132.08,24.77 R26.2
N$57  (via drill 0.5)
  Top 0.305: R35.1 80.01,40.01 75.56,40.01 73.03,37.47 73.03,13.97 71.12,12.06 v71.12,10.79
  Bottom 0.305: X1.5 71.12,6.35 v71.12,10.79
N$58
  Top 0.305: X2.4 120.65,6.99 123.19,9.53 127.33,9.53 130.18,12.37 130.18,15.24 R26.1
N$59
  Top 0.305: X3.4 140.97,10.16 143.51,12.7 156.21,12.7 R27.1
N$60
  Top 0.305: U4.3 144.78,31.75 145.41,32.38 148.59,32.38 149.22,31.75 149.22,26.67 150.5,25.4 150.5,24.13 D4.A R27.2
N$61  (via drill 0.5)
  Top 0.305: R37.1 102.87,42.55 93.98,33.66 93.98,11.43 95.25,10.16 v104.14,10.16
  Bottom 0.305: X1.6 68.58,6.35 68.58,2.54 69.85,1.27 102.87,1.27 104.14,2.54 v104.14,10.16
N$62
  Top 0.305: R37.2 D11.C D12.A R38.1
  Bottom 0.305: Q2.3 102.87,64.77 102.87,58.42 D11.C
N$63  (via drill 0.6)
  Top 0.305: R36.2 106.68,81.28 101.6,76.2 83.19,76.2 81.28,74.3 81.28,73.03 80.64,72.39 79.38,72.39 77.47,70.48 74.56,70.48 72.39,68.32 v72.39,66.04 | U5.3 71.75,55.88 72.39,56.52 v72.39,63.5
  Bottom 0.305: v72.39,66.04 v72.39,63.5
N$64
  Bottom 0.305: R29.1 R28.1 140.97,46.99 142.24,45.72 U4.7
N$65
  Top 0.305: R32.1 R31.1 152.4,41.91 149.86,39.37 149.86,36.83 149.22,36.2 145.41,36.2 144.78,36.83 U4.6
N$66
  Top 0.305: R32.2 C7.2
N$67
  Top 0.305: D29.A D30.C 81.28,80.01 C20.2
N$68
  Top 0.305: PORTA.5 138.43,90.17 141.6,87 141.6,81.92 C5.2 R30.1 D6.C
N$69
  Top 0.305: D7.C 153.52,62.23 154.94,63.65 C7.1 D8.A
N$70
  Top 0.305: D5.C 143.51,64.14 142.88,64.77 C4.1 D6.A
N$71
  Bottom 0.305: C20.1 77.47,73.66 R85.2
N$72
  Top 0.305: PORTA.6 137.16,95.25 137.79,95.89 143.51,95.89 144.15,95.25 144.15,87.63 149.86,81.92 C6.2 R33.1 D8.C
N$73
  Top 0.305: PORTD.8 65.41,95.89 68.58,95.89 71.75,92.71 91.44,92.71 R87.1
N$74
  Bottom 0.305: R39.1 Q3.2
N$75
  Top 0.305: R40.2 D13.C D14.A R41.1
  Bottom 0.305: Q3.3 110.49,64.77 110.49,58.42 D13.C
N$76  (via drill 0.5)
  Top 0.305: R40.1 113.03,38.73 115.57,36.2 115.57,26.67 114.94,26.04 100.33,26.04 99.69,25.4 99.69,18.41 97.79,16.51 v97.79,13.97
  Bottom 0.305: v97.79,13.97 102.23,13.97 102.87,13.34 102.87,3.17 101.6,1.91 73.03,1.91 72.39,2.54 X1.7
N$77
  Bottom 0.305: R42.1 Q4.2
N$78
  Top 0.305: R43.2 D15.C D16.A R44.1
  Bottom 0.305: Q4.3 118.11,64.77 118.11,58.42 D15.C
N$79  (via drill 0.5)
  Top 0.305: R43.1 120.65,40.01 116.84,36.2 116.84,26.04 116.2,25.4 100.97,25.4 100.33,24.77 v100.33,12.7
  Bottom 0.305: v100.33,12.7 100.33,3.81 99.69,3.17 76.83,3.17 76.2,3.81 76.2,5.71 75.56,6.35 73.66,6.35 X1.8
N$80
  Bottom 0.305: R45.1 Q5.2
N$81
  Top 0.305: R46.2 D17.C D18.A R47.1
  Bottom 0.305: Q5.3 125.73,64.77 125.73,58.42 D17.C
N$82  (via drill 0.5)
  Top 0.305: R46.1 128.27,40.64 125.73,38.1 120.65,38.1 118.75,36.2 118.75,25.4 118.11,24.77 101.6,24.77 100.97,24.13 100.97,18.41 101.6,17.78 v101.6,12.7
  Bottom 0.305: v101.6,12.7 101.6,3.17 100.97,2.54 75.56,2.54 74.93,3.17 X1.9
N$83  (via drill 0.6)
  Top 0.305: R39.2 114.3,80.64 107.31,73.66 83.19,73.66 81.28,71.75 81.28,70.48 80.64,69.85 75.19,69.85 74.3,68.95 v74.3,66.04 | U5.4 73.66,53.34 74.3,53.98 v74.3,63.5
  Bottom 0.305: v74.3,66.04 v74.3,63.5
N$84  (via drill 0.6)
  Top 0.305: R42.2 121.92,80.01 114.94,73.03 83.82,73.03 81.92,71.12 81.92,69.85 81.28,69.22 80.01,69.22 76.83,69.22 76.2,68.58 v76.2,66.04 | U5.10 76.2,50.8 74.93,52.07 74.93,61.59 76.2,62.87 v76.2,63.5
  Bottom 0.305: v76.2,66.04 v76.2,63.5
N$85  (via drill 0.6)
  Top 0.305: R45.2 129.54,80.01 121.92,72.39 84.45,72.39 82.55,70.48 82.55,69.22 81.92,68.58 80.64,68.58 78.74,68.58 78.11,67.94 v78.11,66.04 | U5.11 79.38,53.34 80.01,53.98 80.01,60.96 78.11,62.87 v78.11,63.5
  Bottom 0.305: v78.11,66.04 v78.11,63.5
N$86
  Top 0.305: Q6.1 D19.A D20.C
  Bottom 0.305: D20.C 88.27,61.59 88.27,54.61 R49.2
N$87
  Bottom 0.305: Q6.2 R48.1
N$88
  Top 0.305: R49.1 86.36,38.73 75.56,38.73 73.66,36.83 73.66,11.43 74.93,10.16 X1.10
N$89
  Top 0.305: D22.C Q7.1 | R51.2 D21.A
  Bottom 0.305: D21.A 97.79,58.42 100.33,60.96 D22.C
N$90
  Bottom 0.305: R50.1 Q7.2
N$91  (via drill 0.5)
  Top 0.305: R51.1 97.79,38.73 92.71,33.66 v92.71,12.7
  Bottom 0.305: v92.71,12.7 92.71,12.06 93.98,10.79 97.79,10.79 99.06,9.53 99.06,4.45 98.42,3.81 78.11,3.81 77.47,4.45 X1.11
N$93
  Top 0.305: Q10.G D25.C 59.69,28.57 60.33,27.94 R64.1 66.04,27.94 | 66.04,27.94 R62.2 | C11.2 66.04,27.94
N$95
  Top 0.305: Q11.G D26.C 59.69,14.61 60.33,13.97 R68.1 66.04,13.97 | 66.04,13.97 R66.2 | C12.2 66.04,13.97
N$97
  Top 0.305: Q12.G D27.C 104.14,28.57 104.78,27.94 R72.1 110.49,27.94 | 110.49,27.94 R70.2 | C13.2 110.49,27.94
N$99
  Top 0.305: Q13.G D28.C 104.14,15.88 104.78,15.24 R76.1 110.49,15.24 | 110.49,15.24 R74.2 | C14.2 110.49,15.24
N$100  (via drill 0.5)
  Top 0.305: R54.1 39.37,26.67 41.27,24.77 66.67,24.77 67.31,24.13 v68.58,24.13
  Bottom 0.305: X1.14 80.01,8.89 76.2,12.7 76.2,23.5 75.56,24.13 v68.58,24.13
N$101  (via drill 0.5)
  Top 0.305: R55.1 41.27,29.84 45.09,29.84 49.53,25.4 v68.58,25.4
  Bottom 0.305: X1.15 81.28,6.35 81.28,8.89 76.83,13.34 76.83,24.77 76.2,25.4 v68.58,25.4
N$102
  Top 0.305: R58.1 39.37,12.7 41.27,10.79 66.67,10.79 68.58,8.89 68.58,3.17 69.22,2.54 85.46,2.54 86.36,3.44 86.36,5.71 85.72,6.35 83.82,6.35 X1.16
N$103
  Top 0.305: R59.1 41.27,15.88 45.09,15.88 49.53,11.43 68.58,11.43 71.12,8.89 71.12,3.81 71.75,3.17 84.45,3.17 85.09,3.81 X1.17
N$104
  Top 0.305: R62.1 80.01,27.94 81.28,26.67 81.28,16.51 85.09,12.7 X1.18
N$105
  Top 0.305: R63.1 81.92,31.75 83.82,29.84 83.82,15.88 88.9,10.79 88.9,6.35 X1.19
N$106
  Bottom 0.305: R66.1 83.19,9.53 87,9.53 87.63,8.89 X1.20
N$107
  Bottom 0.305: R67.1 85.72,10.79 88.27,10.79 88.9,10.16 88.9,6.35 X1.21
N$108
  Top 0.305: X1.22 91.44,8.89 106.05,8.89 111.12,13.97 116.84,13.97 118.75,15.88 118.75,24.13 120.02,25.4 120.02,26.67 121.28,27.94 R70.1
N$109
  Top 0.305: X1.23 93.98,3.81 108.58,3.81 110.49,5.71 110.49,7.62 113.03,10.16 118.11,10.16 120.02,12.06 124.46,12.06 127,14.61 127,30.48 125.73,31.75 R71.1
N$110
  Top 0.305: X1.24 93.98,6.35 107.31,6.35 107.95,6.99 107.95,8.89 111.76,12.7 116.84,12.7 119.38,15.24 R74.1
N$111
  Top 0.305: X1.25 107.95,5.08 109.22,6.35 109.22,8.26 112.39,11.43 117.47,11.43 119.38,13.34 123.83,13.34 125.09,14.61 125.09,18.41 124.46,19.05 R75.1
N$112
  Bottom 0.305: LED13.K R79.2
N$113
  Bottom 0.305: LED14.K R80.2
N$114
  Top 0.305: LED15.K R81.2
N$115
  Top 0.305: R82.2 LED16.K
N$116
  Top 0.305: PORTD.9 70.48,91.44 71.75,90.17 92.08,90.17 R88.1
N$117
  Bottom 0.406: R89.1 40.64,94.35 39.74,95.25 25.4,95.25 PORTB.6
N$118
  Top 0.305: R55.2 R53.2 C9.1 Q8.D 20.64,35.56 13.65,28.57 13.34,28.57 R77.1
N$119
  Top 0.305: R63.2 R61.2 C11.1 Q10.D 60.01,35.56 53.02,28.57 52.7,28.57 R79.1
N$120
  Top 0.305: R67.2 R65.2 C12.1 Q11.D 60.01,21.59 53.02,14.61 52.7,14.61 R80.1
N$121
  Top 0.305: R75.2 R73.2 C14.1 Q13.D 104.46,22.86 101.92,20.32 101.92,18.73 102.87,17.78 102.87,12.06 102.23,11.43 97.79,11.43 96.52,12.7 R82.1
N$122
  Top 0.305: R71.2 R69.2 C13.1 Q12.D 104.46,35.56 97.47,28.57 97.16,28.57 R81.1
OCC_RES_BOT
  Top 0.305: U2.15 63.5,66.04 64.14,66.67 69.85,66.67 71.12,67.94 71.12,68.58 73.66,71.12 74.3,71.12 78.74,75.56 80.01,75.56 81.28,76.83 94.61,76.83 99.06,81.28 R50.2
  Top 0.406: U2.15 R18.1 R96.2
OCC_RES_TOP
  Top 0.305: U2.9 48.26,66.67 49.53,67.94 69.22,67.94 73.03,71.75 73.66,71.75 78.11,76.2 79.38,76.2 80.64,77.47 87.63,77.47 91.44,81.28 R48.2
  Top 0.406: U2.9 R15.1 R95.2
OUTPUT_ENABLE
  Top 0.305: U1.9 25.4,67.94 26.67,69.22 66.67,69.22 68.58,71.12 68.58,84.19 70.11,85.72 83.19,85.72 R34.2
  Top 0.406: U1.9 R11.1
  Bottom 0.406: R90.2 R11.1
SPARE_SW_INPUT_BOT  (via drill 0.5)
  Top 0.305: R20.2 19.05,43.18 22.23,40.01 69.85,40.01 72.39,37.47 72.39,23.5 71.75,22.86 v71.75,21.59
  Top 0.406: R22.2 R20.2
  Bottom 0.305: X1.13 78.74,6.35 78.74,8.89 72.39,15.24 72.39,20.95 v71.75,21.59
SPARE_SW_INPUT_TOP  (via drill 0.5)
  Top 0.305: R19.2 8.89,44.45 14.61,38.73 69.85,38.73 71.75,36.83 71.75,24.13 70.48,22.86 v70.48,21.59
  Top 0.406: R21.2 R19.2
  Bottom 0.305: X1.12 77.47,8.89 71.75,14.61 71.75,20.32 v70.48,21.59

### Text on the board
Top: Design by JSIF | 01-2012 | OPTO_BOARD2 | MISC
tNames: 2 | 2 | 2 | 2 | Design by JSIF | 1 | 1 | 1 | 1 | 01-2012 | OPTO_BOARD2 | MISC | 2 | 26 | 12V | 1 | 6 | 1 | 6 | 1 | 25 | 5V